# Altium schematic sheet ConnWB.SchDoc: ConectoresWB-MPU9150
size A4
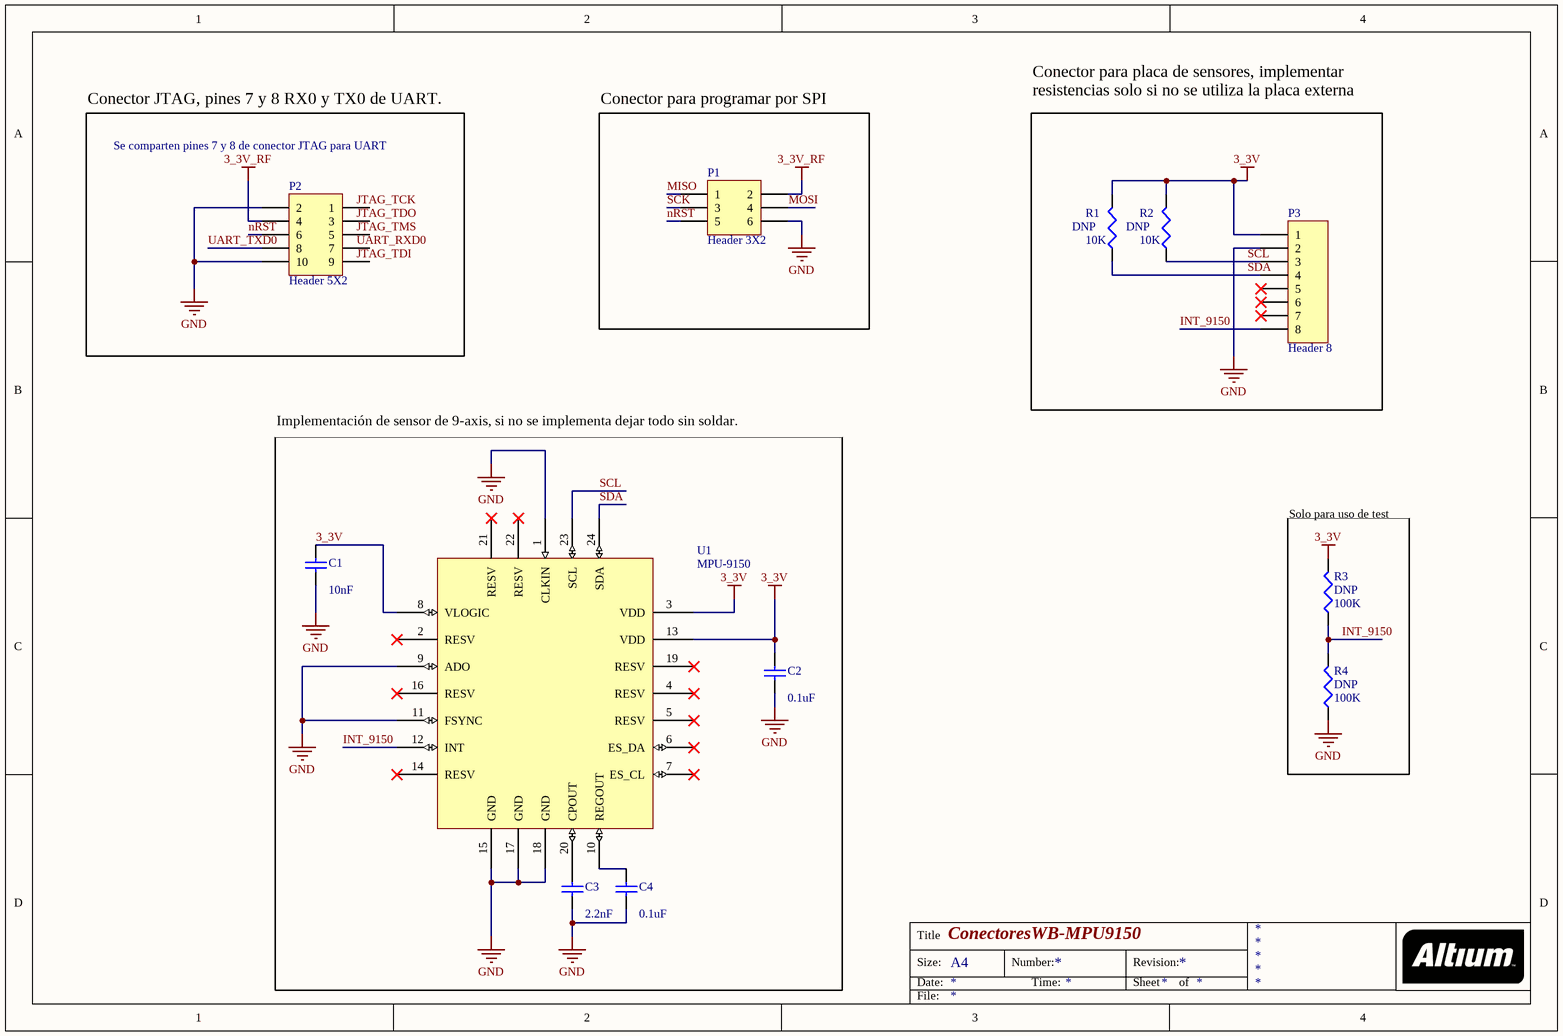
[diagram p0: ConnWB.SchDoc]

## Parts
C1  value 10nF  [1608[0603]]  (hidden comment: Cap Semi)
C2  value 0.1uF  [C1206]  (hidden comment: Cap Semi)
C3  value 2.2nF  [1608[0603]]  (hidden comment: Cap Semi)
C4  value 0.1uF  [1608[0603]]  (hidden comment: Cap Semi)
P1  Header 3X2  [HDR2X3]
P2  Header 5X2  [HDR2X5]
P3  Header 8  [Conector8]
R1  DNP  value 10K  [6-0805_M]
R2  DNP  value 10K  [6-0805_M]
R3  DNP  value 100K  [6-0805_M]
R4  DNP  value 100K  [6-0805_M]
U1  MPU-9150  [QFP-24]

## Blocks framed on the sheet
Se comparten pines 7 y 8 de conector JTAG para UART: P2

## Nets
3_3V: C1.2 C2.1 P3.1 R1.2 R2.2 R3.2 U1.3(VDD) U1.8(VLOGIC) U1.13(VDD)
3_3V_RF: P1.2 P2.4
GND: C1.1 C2.2 C3.1 C4.1 P1.6 P2.2 P2.10 P3.2 R4.1 U1.1(CLKIN) U1.9(ADO) U1.11(FSYNC) U1.15(GND) U1.17(GND) U1.18(GND)
INT_9150: P3.8 R3.1 R4.2 U1.12(INT)
MISO: P1.1
MOSI: P1.4
nRST: P1.5 P2.6
SCK: P1.3
SCL: P3.3 R2.1 U1.23(SCL)
SDA: P3.4 R1.1 U1.24(SDA)
UART_TXD0: P2.8
NetC3_2: C3.2 U1.20(CPOUT)
NetC4_2: C4.2 U1.10(REGOUT)

Not connected (* = marked no-connect by the designer): P2 1 3 5 7 9; P3 5* 6* 7*; U1 2(RESV)* 4(RESV)* 5(RESV)* 6(ES_DA)* 7(ES_CL)* 14(RESV)* 16(RESV)* 19(RESV)* 21(RESV)* 22(RESV)*

## Notes on the sheet
- Conector JTAG, pines 7 y 8 RX0 y TX0 de UART.
- Conector para programar por SPI
- Conector para placa de sensores, implementar
  resistencias solo si no se utiliza la placa externa
- Implementación de sensor de 9-axis, si no se implementa dejar todo sin soldar.
- Solo para uso de test
- Labels drawn without touching a wire or pin: JTAG_TCK, JTAG_TDI, JTAG_TDO, JTAG_TMS, UART_RXD0
- Title
- Size:
- Date:
- A4
- Number:
- Time:
- Revision:
- Sheet
- of
- File:

## Library data of the parts
C1-C4 = Cap Semi: Capacitor (Semiconductor SIM Model); Published: 8-Jun-2000; LatestRevisionDate: 29-May-2009; LatestRevisionNote: IPC-7351 Footprint Added.; PackageReference: C1206; Publisher: Altium Limited; PackageDescription: Chip Capacitor
P1 = Header 3X2: Header, 3-Pin, Dual row; LatestRevisionDate: 17-Jul-2002; LatestRevisionNote: Re-released for DXP Platform.; Publisher: Altium Limited
P2 = Header 5X2: Header, 5-Pin, Dual row; LatestRevisionDate: 17-Jul-2002; LatestRevisionNote: Re-released for DXP Platform.; Publisher: Altium Limited
P3 = Header 8: Header, 8-Pin; LatestRevisionDate: 17-Jul-2002; LatestRevisionNote: Re-released for DXP Platform.; Publisher: Altium Limited
R1-R4 = Res3: Resistor; Published: 8-Jun-2000; LatestRevisionDate: 29-May-2009; LatestRevisionNote: IPC-7351 Footprint Added.; PackageReference: J1-0603; Publisher: Altium Limited; PackageDescription: Chip Resistor
U1 = MPU-9150: Integrated 9-axis MotionTracking device